# Altium schematic sheet senzor.SchDoc
size A
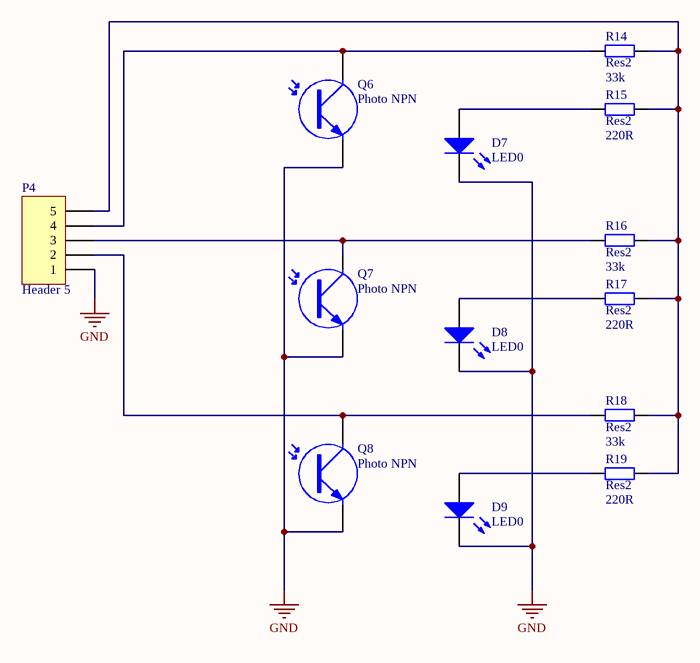
[diagram p0: senzor.SchDoc]

## Parts
D7  LED0  [LED-0]
D8  LED0  [LED-0]
D9  LED0  [LED-0]
P4  Header 5  [HDR1X5]
Q6  Photo NPN  [TO-220_A]
Q7  Photo NPN  [TO-220_A]
Q8  Photo NPN  [TO-220_A]
R14  Res2  value 33k  [AXIAL-0.4]
R15  Res2  value 220R  [AXIAL-0.4]
R16  Res2  value 33k  [AXIAL-0.4]
R17  Res2  value 220R  [AXIAL-0.4]
R18  Res2  value 33k  [AXIAL-0.4]
R19  Res2  value 220R  [AXIAL-0.4]

## Nets
GND: D7.2(K) D8.2(K) D9.2(K) P4.1 Q6.3(E) Q7.3(E) Q8.3(E)
NetD7_1: D7.1(A) R15.1
NetD8_1: D8.1(A) R17.1
NetD9_1: D9.1(A) R19.1
NetP4_2: P4.2 Q8.1(C) R18.1
NetP4_3: P4.3 Q7.1(C) R16.1
NetP4_4: P4.4 Q6.1(C) R14.1
NetP4_5: P4.5 R14.2 R15.2 R16.2 R17.2 R18.2 R19.2

## Library data of the parts
D7-D9 = LED0: Typical INFRARED GaAs LED; Published: 8-Jun-2000; LatestRevisionDate: 08-Jul-2005; LatestRevisionNote: Mech Layer 1 removed.; PackageReference: LED-0; Publisher: Altium Limited; PackageDescription: LED; 2 Leads
P4 = Header 5: Header, 5-Pin; LatestRevisionDate: 17-Jul-2002; LatestRevisionNote: Re-released for DXP Platform.; Publisher: Altium Limited
Q6-Q8 = Photo NPN: NPN Phototransistor; Published: 24-Mar-1999; LatestRevisionDate: 17-Jul-2002; LatestRevisionNote: Re-released for DXP Platform.; PackageReference: TO-220_A; Publisher: Altium Limited; Code_JEDEC: TO-220-AC
R14-R19 = Res2: Resistor; Published: 8-Jun-2000; LatestRevisionDate: 17-Jul-2002; LatestRevisionNote: Re-released for DXP Platform.; PackageReference: AXIAL-0.4; Publisher: Altium Limited; PackageDescription: Axial Device, Thru-Hole; 2 Leads; 0.4 in Pin Spacing